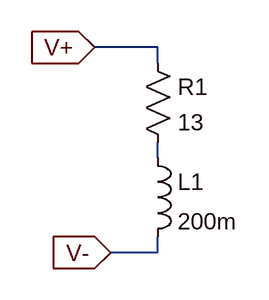
[diagram p0: schematic mysol.asc]
mysol.asc, the LTspice schematic file:
Version 4
SHEET 1 880 680
WIRE 272 144 208 144
WIRE 272 160 272 144
WIRE 272 256 272 240
WIRE 272 352 272 336
WIRE 272 352 224 352
FLAG 208 144 V+
IOPIN 208 144 In
FLAG 224 352 V-
IOPIN 224 352 In
SYMBOL res 256 144 R0
SYMATTR InstName R1
SYMATTR Value 13
SYMBOL ind 256 240 R0
SYMATTR InstName L1
SYMATTR Value 200m

The netlist it stands for:
* mysol.asc
R1 V+ N001 13
L1 N001 V- 200m
.backanno
.end